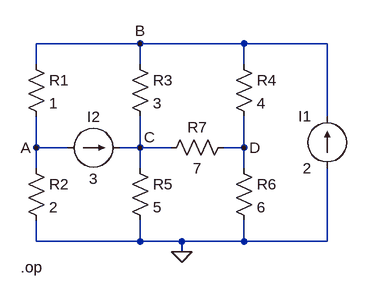
[diagram p0: schematic Circuito1.asc]
Circuito1.asc, the LTspice schematic file:
Version 4
SHEET 1 880 680
WIRE -1232 -320 -1392 -320
WIRE -1072 -320 -1232 -320
WIRE -944 -320 -1072 -320
WIRE -1392 -288 -1392 -320
WIRE -1232 -288 -1232 -320
WIRE -1072 -288 -1072 -320
WIRE -944 -208 -944 -320
WIRE -1392 -160 -1392 -208
WIRE -1344 -160 -1392 -160
WIRE -1232 -160 -1232 -208
WIRE -1232 -160 -1264 -160
WIRE -1184 -160 -1232 -160
WIRE -1072 -160 -1072 -208
WIRE -1072 -160 -1104 -160
WIRE -1392 -128 -1392 -160
WIRE -1232 -128 -1232 -160
WIRE -1072 -128 -1072 -160
WIRE -1392 -16 -1392 -48
WIRE -1232 -16 -1232 -48
WIRE -1232 -16 -1392 -16
WIRE -1168 -16 -1232 -16
WIRE -1072 -16 -1072 -48
WIRE -1072 -16 -1168 -16
WIRE -944 -16 -944 -128
WIRE -944 -16 -1072 -16
WIRE -1168 0 -1168 -16
FLAG -1168 0 0
FLAG -1392 -160 A
FLAG -1232 -320 B
FLAG -1232 -160 C
FLAG -1072 -160 D
SYMBOL res -1408 -304 R0
SYMATTR InstName R1
SYMATTR Value 1
SYMBOL res -1248 -304 R0
SYMATTR InstName R3
SYMATTR Value 3
SYMBOL res -1408 -144 R0
SYMATTR InstName R2
SYMATTR Value 2
SYMBOL res -1248 -144 R0
SYMATTR InstName R5
SYMATTR Value 5
SYMBOL res -1088 -304 R0
SYMATTR InstName R4
SYMATTR Value 4
SYMBOL res -1088 -144 R0
SYMATTR InstName R6
SYMATTR Value 6
SYMBOL current -944 -128 R180
WINDOW 0 24 80 Left 2
WINDOW 3 24 0 Left 2
SYMATTR InstName I1
SYMATTR Value 2
SYMBOL current -1344 -160 R270
WINDOW 0 32 40 VTop 2
WINDOW 3 -32 40 VBottom 2
SYMATTR InstName I2
SYMATTR Value 3
SYMBOL res -1088 -176 R90
WINDOW 0 0 56 VBottom 2
WINDOW 3 32 56 VTop 2
SYMATTR InstName R7
SYMATTR Value 7
TEXT -1416 24 Left 2 !.op

The netlist it stands for:
* Circuito1.asc
R1 B A 1
R3 B C 3
R2 A 0 2
R5 C 0 5
R4 B D 4
R6 D 0 6
I1 0 B 2
I2 A C 3
R7 D C 7
.op
.backanno
.end

* Results of the author's LTspice run, read from the files saved beside the schematic
* Operating Point:
*   V(b) = 3.336 V
*   V(a) = 223.7 mV
*   V(c) = 6.76 V
*   V(d) = 3.216 V
*   I(I1) = 2 A
*   I(I2) = 3 A
*   I(R1) = 3.112 A
*   I(R3) = -1.142 A
*   I(R2) = 111.8 mA
*   I(R5) = 1.352 A
*   I(R4) = 29.78 mA
*   I(R6) = 536.1 mA
*   I(R7) = -506.3 mA